# Altium schematic sheet Power Management.SchDoc (part 3 of 3)
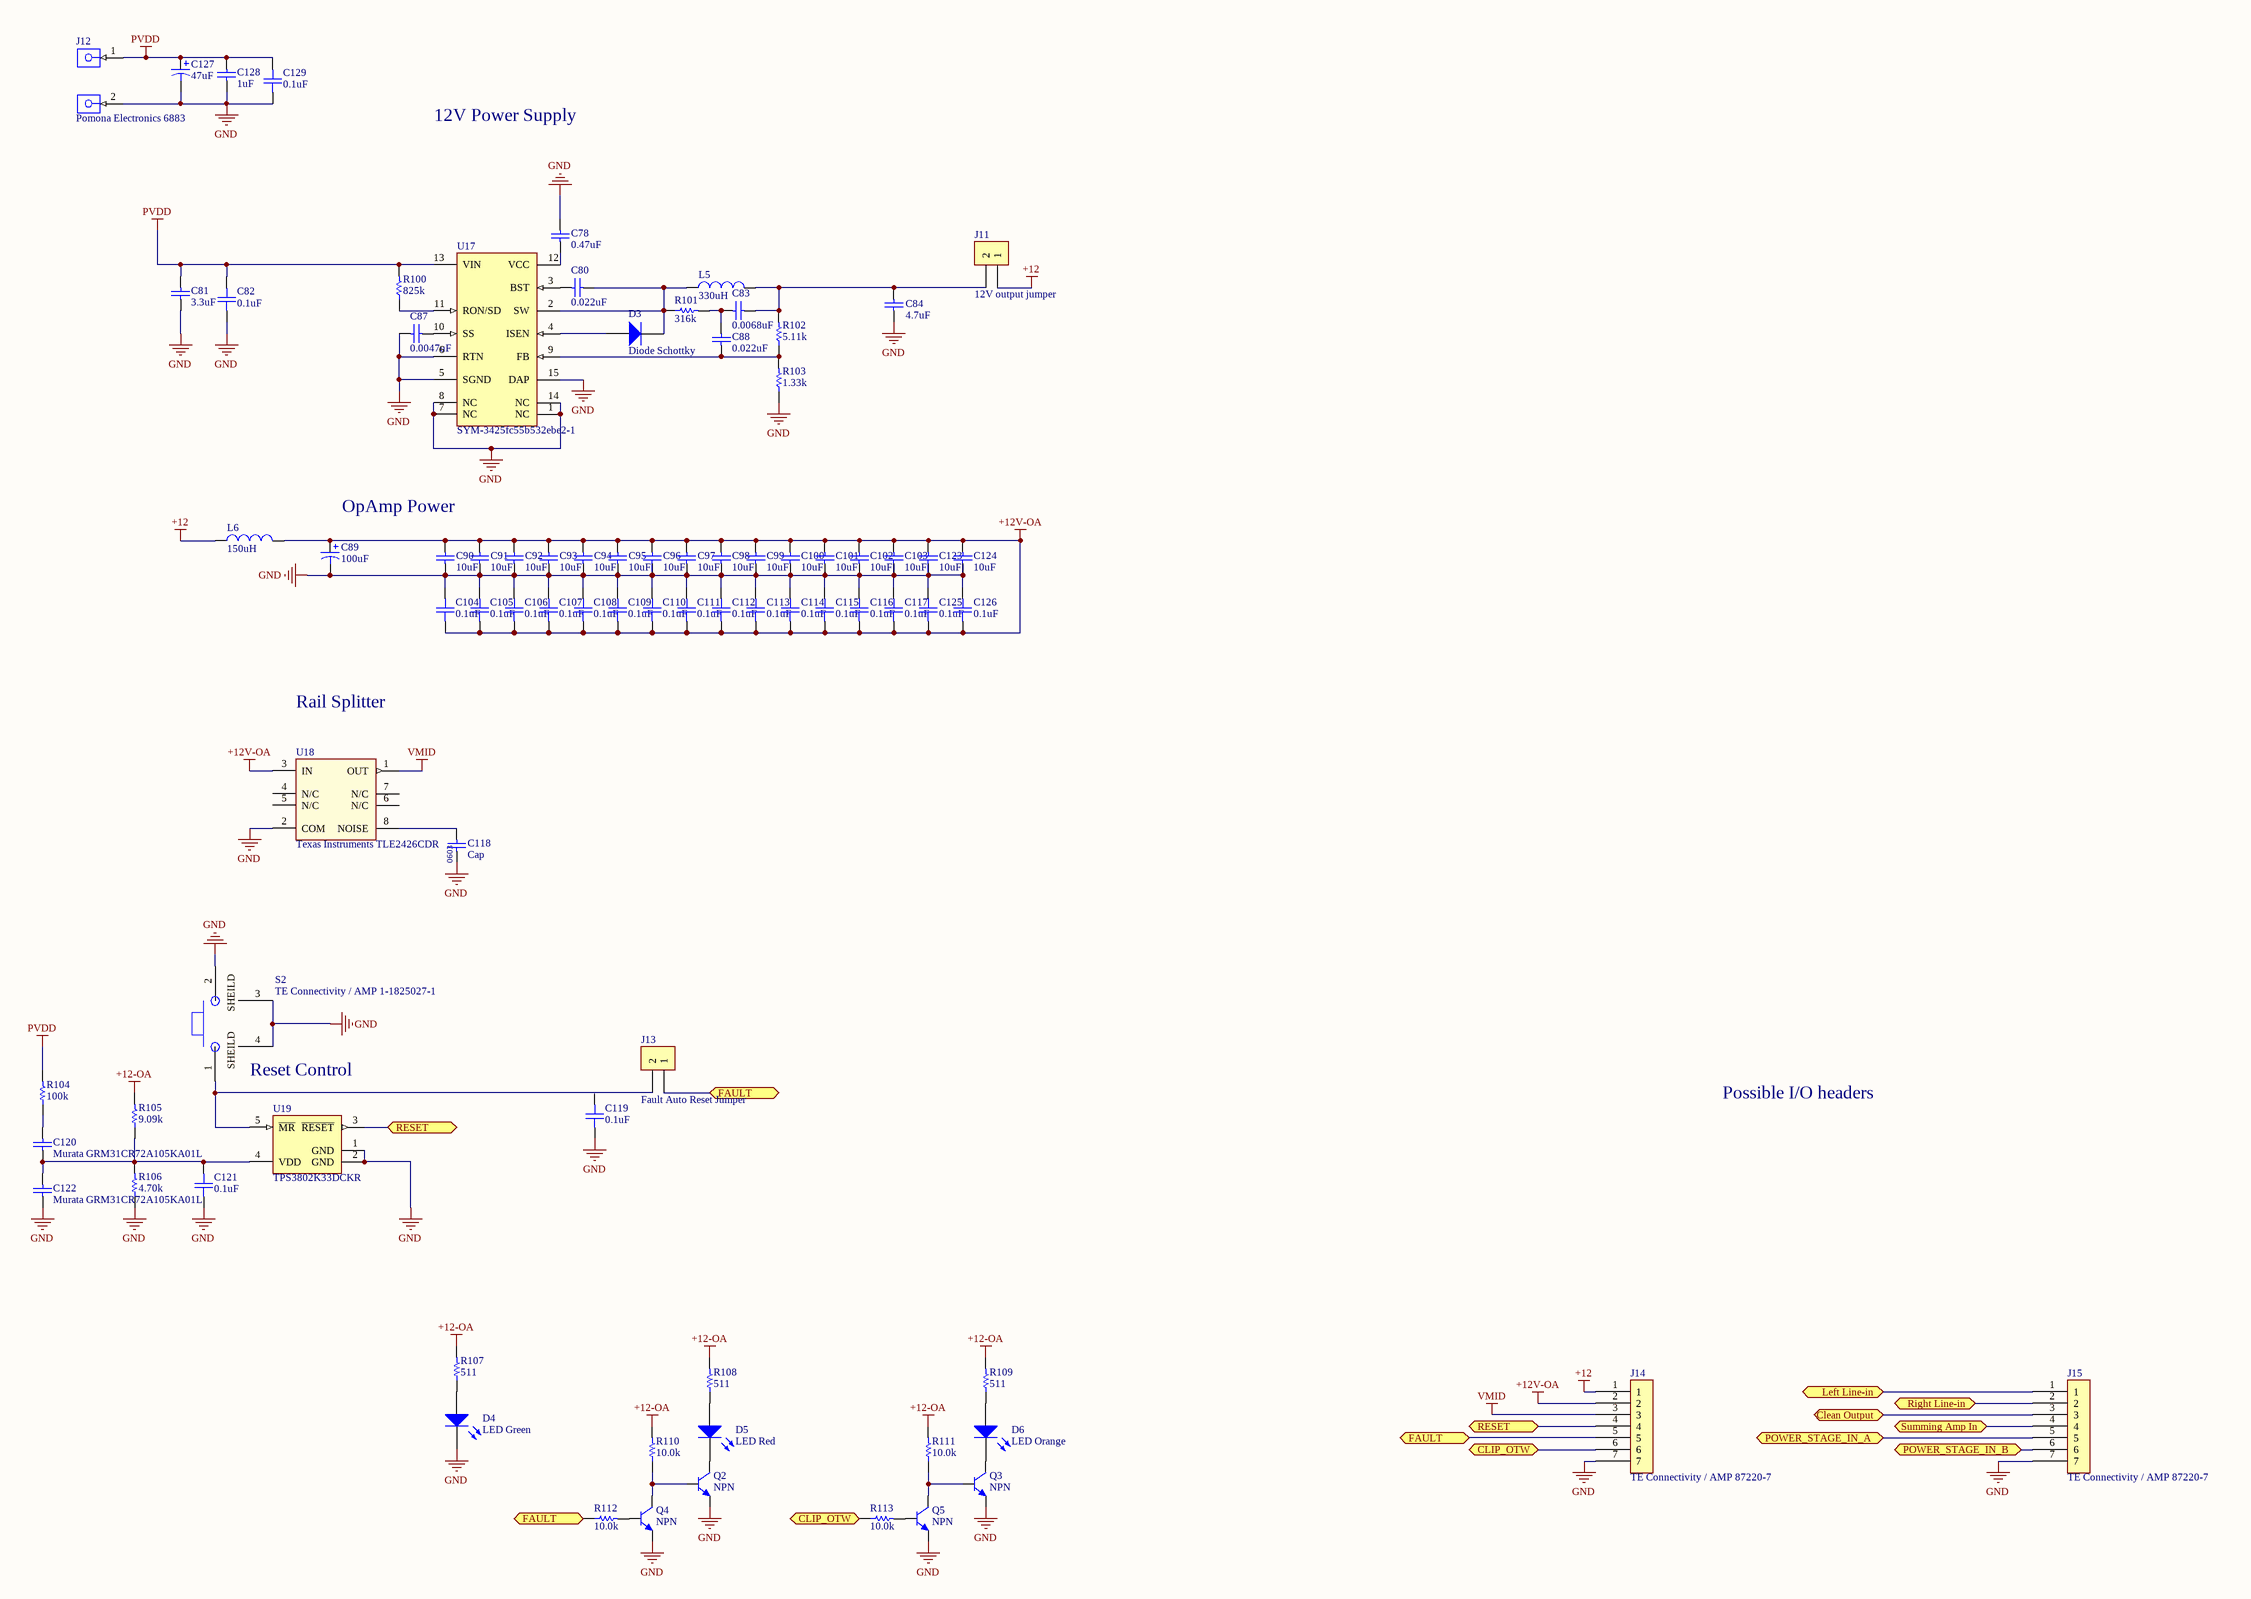
[diagram p2: Power Management.SchDoc]

## Library data of the parts (continued)
C89 = CMP-0978c15ef0cfd6bf-1 (continued):  Automotive T/R; Manufacturer Part Number: UCD1E101MCL1GS; Manufacturer: Nichicon; Voltage Rating (DC): 25.0 V
C90-C103 C123 C124 = CMP-a7396f2fa7ef78fe-6: CL31 Series 10 uF 25 V ±10 % Tolerance X7R SMT Multilayer Ceramic Capacitor; Voltage Rating (DC): 25.0 V; Capacitance Tolerance: ±10%; Capacitance: 10.0 µF; Lead-Free Status: Lead Free; Octopart URL: http://octopart.com/cl31b106kahnnne-samsung-18621872; Dielectric Characteristic: X7R; RoHS: Compliant; OctopartID: a7396f2fa7ef78fe; Case/Package: 1206
C118 = CMP-463c8d25af8a99fb-1: 0603 1 uF 16V ±10% Tolerance X7R SMT Multilayer Ceramic Capacitor; Manufacturer Part Number: GRM188R71C105KE15D; Capacitance: 1.00 µF; Voltage Rating (DC): 16.0 V; Case/Package (SI): 1608; Lead-Free Status: Lead Free; Size-Length: 1.60 mm; Case/Package: 0603, 1608; RoHS: Compliant; Size-Width: 800 µm; Lifecycle Status: Active; OctopartID: 463c8d25af8a99fb; Capacitance Tolerance: ±10%; Dielectric Characteristic: X7R
C120 C122 = CMP-19299756-2: CAP CER 1UF 100V 10% X7R 1206; Capacitance: 1e-06 F; Case/Package (SI): 3216; Dielectric Material: Ceramic Multilayer; Lead-Free Status: Lead Free; Voltage Rating (DC): 100.0 V; Capacitance Tolerance: ±10%; Dielectric Characteristic: X7R; Mounting Style: Surface Mount; Number of Pins: 2; Octopart Url: https://octopart.com/grm31cr72a105ka01l-murata-197461; OctopartID: bb66726f9d5564a1; REACH SVHC Compliance: No SVHC; RoHS: Compliant; Size-Length: 0.0032 m; Size-Thickness: 0.0016 m; Size-Width: 0.0016 m
C127 = CMP-6614abbd7d9eb9d3-1: Cap Aluminum Lytic 47uF 100V 20% (10 X 10.2mm) SMD 170mA 2000h 105C T/R
C128 = CMP-19299756-2: CAP CER 1UF 100V 10% X7R 1206; Manufacturer: Murata; Manufacturer Part Number: GRM31CR72A105KA01L; Capacitance: 1e-06 F; Case/Package (SI): 3216; Dielectric Material: Ceramic Multilayer; Lead-Free Status: Lead Free; Voltage Rating (DC): 100.0 V; Capacitance Tolerance: ±10%; Dielectric Characteristic: X7R; Mounting Style: Surface Mount; Number of Pins: 2; Octopart Url: https://octopart.com/grm31cr72a105ka01l-murata-197461; OctopartID: bb66726f9d5564a1; REACH SVHC Compliance: No SVHC; RoHS: Compliant; Size-Length: 0.0032 m; Size-Thickness: 0.0016 m; Size-Width: 0.0016 m
D3 = CMP-3c2bf027d984e3ec-1: 10 Amp 150V Ultra-Low VF schottky rectifier / TAPE REEL; Manufacturer Part Number: FSV10150V; Manufacturer: ON Semiconductor; Lead-Free Status: Lead Free; OctopartID: 3c2bf027d984e3ec; Octopart URL: http://octopart.com/fsv10150v-on+semiconductor-84328649; Lifecycle Status: Not Listed by Manufacturer; Mounting Style: Surface Mount
D4 = CMP-d13a1838906e0efd-2: Green 1.6 x 0.6 x 1.15 mm 130° Water Clear 18 to 78 mcd 2 V SMT LED; Manufacturer: Lite-On; Manufacturer Part Number: LTST-S270KGKT; Lens Type: Non-Diffused; Forward Voltage: 2.00 V; Luminous Intensity: 35.0 mcd; Case/Package (SI): 1608; Wavelength: 574 nm; Octopart URL: http://octopart.com/ltst-s270kgkt-lite-on-549938; OctopartID: d13a1838906e0efd; Viewing Angle: 130 °; Size-Height: 1.15 mm; Case/Package: 0603; Packaging: Cut Tape (CT), Tape & Reel (TR); Color: Green
D5 = CMP-1417dd155542cbd0-5: LED; SMD; 0604; red; 18-54mcd; 1.6x1.15x0.6mm; 130°; 2÷2.4V; 20mA; Manufacturer Part Number: LTST-S270KRKT; Manufacturer: Lite-On; Forward Voltage: 2.00 V; Wavelength: 639 nm; Luminous Intensity: 54.0 mcd; Lead-Free Status: Lead Free; Lens Type: Non-Diffused; Size-Width: 600 µm; Size-Length: 2.10 mm; Packaging: Cut Tape (CT), Tape & Reel (TR)
D6 = CMP-31d7f8d570b5ee10-2: Orange 1.6 x 0.6 mm 130º 90 mcd 2 V Water Clear Surface Mount Chip LED; Manufacturer Part Number: LTST-S270KFKT; Manufacturer: Lite-On; Lead-Free Status: Lead Free; Wavelength: 611 nm; Forward Voltage: 2.00 V; Luminous Intensity: 60.0 mcd; Lens Type: Non-Diffused; Mounting Style: Surface Mount; Packaging: Cut Tape (CT), Tape & Reel (TR); Color: Orange; OctopartID: 31d7f8d570b5ee10; Size-Width: 600 µm; RoHS: Compliant; Case/Package: 0603
J11 J13 = CMP-2792ecc2f21af855-16: Connector Unshrouded Header 2 Position 2.54mm Solder Straight Thru-Hole
J12 = CMP-19368571-3: DUAL BINDING POSTS; Wire Gauge: 12.0 AWG; Lead-Free Status: Lead Free; Current Rating: 30.0 A; Octopart Url: https://octopart.com/6883-pomona+electronics-2074; Mounting Style: Panel; OctopartID: 47678e6d6a1b98a0; RoHS: Compliant; Color: Black; Contact Plating: Nickel; Contact Material: Brass; REACH SVHC Compliance: No SVHC; Insulation Material: Nylon
J14 J15 = CMP-ebeb20bb2956342c-1: AMPMODU 7 Position Through-Hole Single Row Straight 0.1 Inch Header; Gender: Male; Lead-Free Status: Lead Free; Number of Positions: 7; Mounting Angle: 180 °; Pin Pitch: 2.54 mm; Housing Color: Black; RoHS: Compliant; Manufacturer Part Number: 87220-7; Orientation: Vertical; Octopart URL: http://octopart.com/87220-7-te+connectivity+%2F+amp-39512027; Size-Length: 17.4 mm; Packaging: Bulk; Flammability Rating: UL 94 V-0; Mounting Style: PCB; Color: Black; OctopartID: ebeb20bb2956342c; Lifecycle Status: Active; Number of Contacts: 7; Number of Rows: 1; Housing Material: Thermoplastic
L5 = CMP-f7073f765ac228c0-1: Power inductor, shielded, 10/20% tol, SMT, RoHS
L6 = CMP-1963d06f268dc6a4-1: SLF Series 12.5 x 12.5 mm 150 uH ±20 % Tol. 1.5 A Shielded SMT Power Inductor; Manufacturer Part Number: SLF12575T-151M1R5-PF; Manufacturer: TDK; Lead-Free Status: Lead Free; Shielding: Yes; Inductance: 150 µH; Mounting Style: Surface Mount; Octopart URL: http://octopart.com/slf12575t-151m1r5-pf-tdk-400008; OctopartID: 1963d06f268dc6a4; Packaging: Bulk, Tape & Reel (TR)
Q2-Q5 = CMP-857793-5: Bipolar (BJT) Single Transistor, General Purpose, NPN, 40 V, 300 MHz, 225 mW, 600 mA, 300
R100 = CMP-1319d8bf3abaccde-1: Res Thin Film 0603 825K Ohm 1% 1/10W ±50ppm/°C Molded SMD SMD Paper T/R; Lead-Free Status: Lead Free; Resistance: 825 kΩ; Voltage Rating (DC): 75.0 V; Mounting Style: Surface Mount; OctopartID: 1319d8bf3abaccde
R101 = CMP-8e64436f049d51a3-1: Surface Mount Thin Film Resistor, MCT Series, 316 kohm, 100 mW, - 0.1%, 75 V; Manufacturer: Vishay; Manufacturer Part Number: MCT06030E3163BP100; Resistance: 316 kΩ; Power Rating: 100 mW; Case/Package (SI): 1608; Lead-Free Status: Lead Free; Octopart URL: https://octopart.com/mct06030e3163bp100-vishay-67219359; RoHS: Compliant; Packaging: Cut Tape (CT); Resistance Tolerance: ±0.1%; OctopartID: 8e64436f049d51a3; REACH SVHC Compliance: No SVHC; Case/Package: 0603, 1608; Mounting Style: Surface Mount
R102 = CMP-3220f9ecb51bede7-1: Res Thin Film 0603 5.11K Ohm 0.1% 1/10W ±25ppm/°C Molded SMD SMD Paper T/R; Manufacturer Part Number: MCT06030D5111BP100; Power Rating: 100 mW; Octopart URL: http://octopart.com/mct06030d5111bp100-vishay-46572125; Packaging: Tape & Reel (TR); RoHS: Compliant
R103 = CMP-aade615395077519-1: Res Thnflm 0603 1.33k Ohm 0.1% 1/10w 25ppm/ c Smd
R104 = CMP-b20e79a018766dc9-1: MCT Series 0603 0.125 W 100 kOhm ±0.1% ±25 ppm/K SMT Thin Film Chip Resistor; Manufacturer: Vishay; Power Rating: 125 mW; Case/Package (SI): 1608; Mounting Style: Surface Mount; Octopart URL: http://octopart.com/mct0603md1003bp100-vishay-44338974; OctopartID: b20e79a018766dc9; Resistance Tolerance: ±0.1%; Packaging: Cut Tape (CT); Case/Package: 0603, 1608; RoHS: Compliant; Number of Pins: 2
R105 = CMP-504998d4ca0f8f8e-1: Res Smd 9.09k Ohm 0.1% 1/8w 0603; Manufacturer: Vishay; Manufacturer Part Number: MCT0603MD9091BP100; OctopartID: 504998d4ca0f8f8e; Case/Package: 0603; Octopart URL: http://octopart.com/mct0603md9091bp100-vishay+beyschlag-26722080; Resistance: 9.09k; Packaging: Reel
R106 = CMP-2ab0e11e80e8f577-1: Surface Mount Chip Resistor, Thin Film, MCT Series, 4.7 kohm, 125 mW, 0.1%, 75 V
R107-R109 = CMP-7c87b70a42aea340-1: Res Thin Film 0603 511 Ohm 0.1% 1/10W ±25ppm/°C Molded SMD SMD Paper T/R
R110-R113 = CMP-893e42b9f3a056f9-1: Precision Thin Film Smnt Resistor 0603 Case 10kOhm +/-0.1% 0.1W +/-25ppm/degC; Manufacturer: Vishay; Manufacturer Part Number: MCT06030D1002BP100; Lead-Free Status: Lead Free; Resistance Tolerance: ±0.1%; Voltage Rating (DC): 50.0 V; Resistance: 10.0 kΩ; Power Rating: 100 mW; Packaging: Tape & Reel (TR); RoHS: Compliant; Mounting Style: Surface Mount; Size-Length: 1.55 mm; Size-Width: 850 µm; Octopart URL: http://octopart.com/mct06030d1002bp100-vishay-42819576; Case/Package: 0603; Size-Height: 450 µm
S2 = CMP-4d86860896969241-7: Switch Push Button OFF (ON) SPST Round Button 0.05A 24VDC Momentary Contact PC Pins Thru-Hole; Mounting Style: Through Hole
U17 = CMP-3425fc55b532ebe2-1: 8-75V Wide Vin, 1A Constant On-Time Non-Synchronous Buck egulator 14-HTSSOP -40 to 125; Manufacturer Part Number: LM5010MHX/NOPB; Lead-Free Status: Lead Free; Switching Frequency: 1.00 MHz; Quiescent Current: 650 µA; Output Voltage: 2.50 V (min); Output Current: 1.00 A; Number of Regulated Outputs: 1; Octopart URL: http://octopart.com/lm5010mhx%2Fnopb-texas+instruments-24814705; Topology: Buck; RoHS: Compliant; Packaging: Cut Tape (CT); Case/Package: HTSSOP; OctopartID: 3425fc55b532ebe2
U18 = CMP-84004d2919695bc7-1: The ' ail Splitter' Precision Virtual Ground 8-SOIC; Manufacturer Part Number: TLE2426CDG4; Manufacturer: TI; Lead-Free Status: Lead Free; Supply Voltage (DC): 4.00 V (min); Octopart URL: http://octopart.com/tle2426cdg4-texas+instruments-2340879; Case/Package: SOIC, PDIP; Packaging: Tube; Mounting Style: Surface Mount; OctopartID: 84004d2919695bc7; RoHS: Compliant; Lifecycle Status: Active; Number of Pins: 8
U19 = CMP-4881249-2: Ultra-Small Supply Voltage Supervisor, 1 Supply Monitored, -40 to 85 degC, 5-pin SC70 (DCK), Green (RoHS & no Sb/Br); Lead-Free Status: Lead Free; Quiescent Current: 9e-06 A; Supply Current: 1.3e-05 A; Threshold Voltage: 2.93 V; Case/Package: SOT-323; Lifecycle Status: Active; Mounting Style: Surface Mount; Number of Pins: 5; Octopart Url: https://octopart.com/tps3802k33dckr-texas+instruments-505797; OctopartID: 3e03f70eaca0e1c4; Packaging: Cut Tape (CT); REACH SVHC Compliance: No SVHC; RoHS: Compliant